# Altium schematic sheet ChestStrap_HeartRate.SchDoc
size A
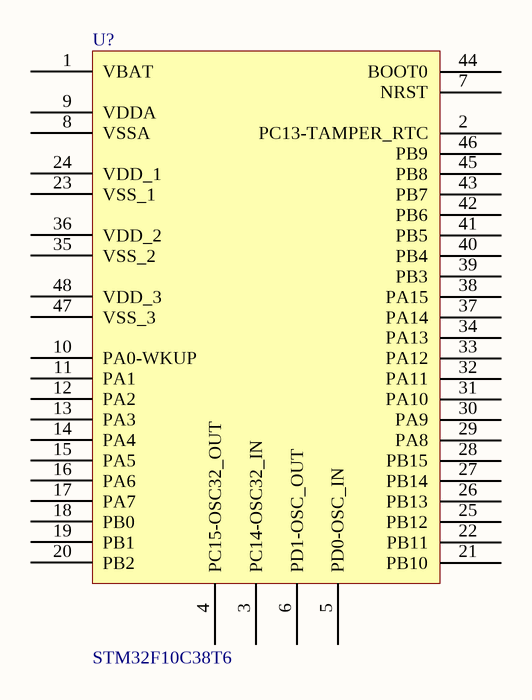
[diagram p0: ChestStrap_HeartRate.SchDoc]

## Parts
U?  STM32F10C38T6

## Nets

Not connected (* = marked no-connect by the designer): U? 1(VBAT) 2(PC13-TAMPER_RTC) 3(PC14-OSC32_IN) 4(PC15-OSC32_OUT) 5(PD0-OSC_IN) 6(PD1-OSC_OUT) 7(NRST) 8(VSSA) 9(VDDA) 10(PA0-WKUP) 11(PA1) 12(PA2) 13(PA3) 14(PA4) 15(PA5) 16(PA6) 17(PA7) 18(PB0) 19(PB1) 20(PB2) 21(PB10) 22(PB11) 23(VSS_1) 24(VDD_1) 25(PB12) 26(PB13) 27(PB14) 28(PB15) 29(PA8) 30(PA9) 31(PA10) 32(PA11) 33(PA12) 34(PA13) 35(VSS_2) 36(VDD_2) 37(PA14) 38(PA15) 39(PB3) 40(PB4) 41(PB5) 42(PB6) 43(PB7) 44(BOOT0) 45(PB8) 46(PB9) 47(VSS_3) 48(VDD_3)

## Library data of the parts
U? = STM32F10C38T6: MCU 32-bit STM32F ARM Cortex M3 RISC 64KB Flash 2.5V/3.3V 48-Pin LQFP T/R; Manufacturer: STMicroelectronics; Manufacturer Part Number: STM32F103C8T6TR; RAM Size: 20KB; Frequency: 72MHz; Max Power Dissipation: 363mW; Interface: I2C,SPI,USB,CAN,IrDA,UART,USART,LIN; Number of I/Os: 37; Number of Timers/Counters: 4; Max Supply Voltage: 3.6V; Min Supply Voltage: 2V; Number of ADC Channels: 10; Oscillator Type: Internal; Data Bus Width: 32b; Watchdog Timer: Yes; Peripherals: POR,PWM,WDT,DMA,Temp Sensor,I2C; Supplier 1: Digi-Key; RoHS: Yes; Category: Microcontrollers; Stock 1: 1085; Pricing 1: 1=5.29000, 10=4.74700, 25=4.48760, 100=3.88930, 250=3.68988, 500=3.31090, 1000=2.79233 (USD); Case/Package: LQFP; Number of Pins: 48; Contact Plating: Gold; Min Operating Temperature: -40°C; Max Operating Temperature: 85°C; Packaging: Tape and Reel; Package Quantity: 2400; Number of Programmable I/O: 37; Max Frequency: 72MHz; Memory Type: FLASH; Memory Size: 64KB; Core Architecture: ARM; Radiation Hardening: No; Lead Free: Lead Free; ComponentLink1URL: https://datasheet.ciiva.com/26817/stm32f103c8t6tr-26817555.pdf?src-supplier=IIIC; ComponentLink1Description: https://datasheet.ciiva.com/26817/stm32f103c8t6tr-26817555.pdf?src-supplier=IIIC; ComponentLink2URL: https://datasheet.ciiva.com/16490/cd00161566-16490885.pdf?src-supplier=Future+Electronics; ComponentLink2Description: https://datasheet.ciiva.com/16490/cd00161566-16490885.pdf?src-supplier=Future+Electronics; ComponentLink3URL: https://datasheet.ciiva.com/12270/cd00161566-12270635.pdf?src-supplier=Mouser; ComponentLink3Description: https://datasheet.ciiva.com/12270/cd00161566-12270635.pdf?src-supplier=Mouser; Supplier Part Number 1: 497-17666-1-ND